# Altium schematic sheet sensors.SchDoc: On-Board Sensors
size A4; DrawnBy: Juan I Carrano; DocumentNumber: 4; SheetNumber: 4; SheetTotal: 6
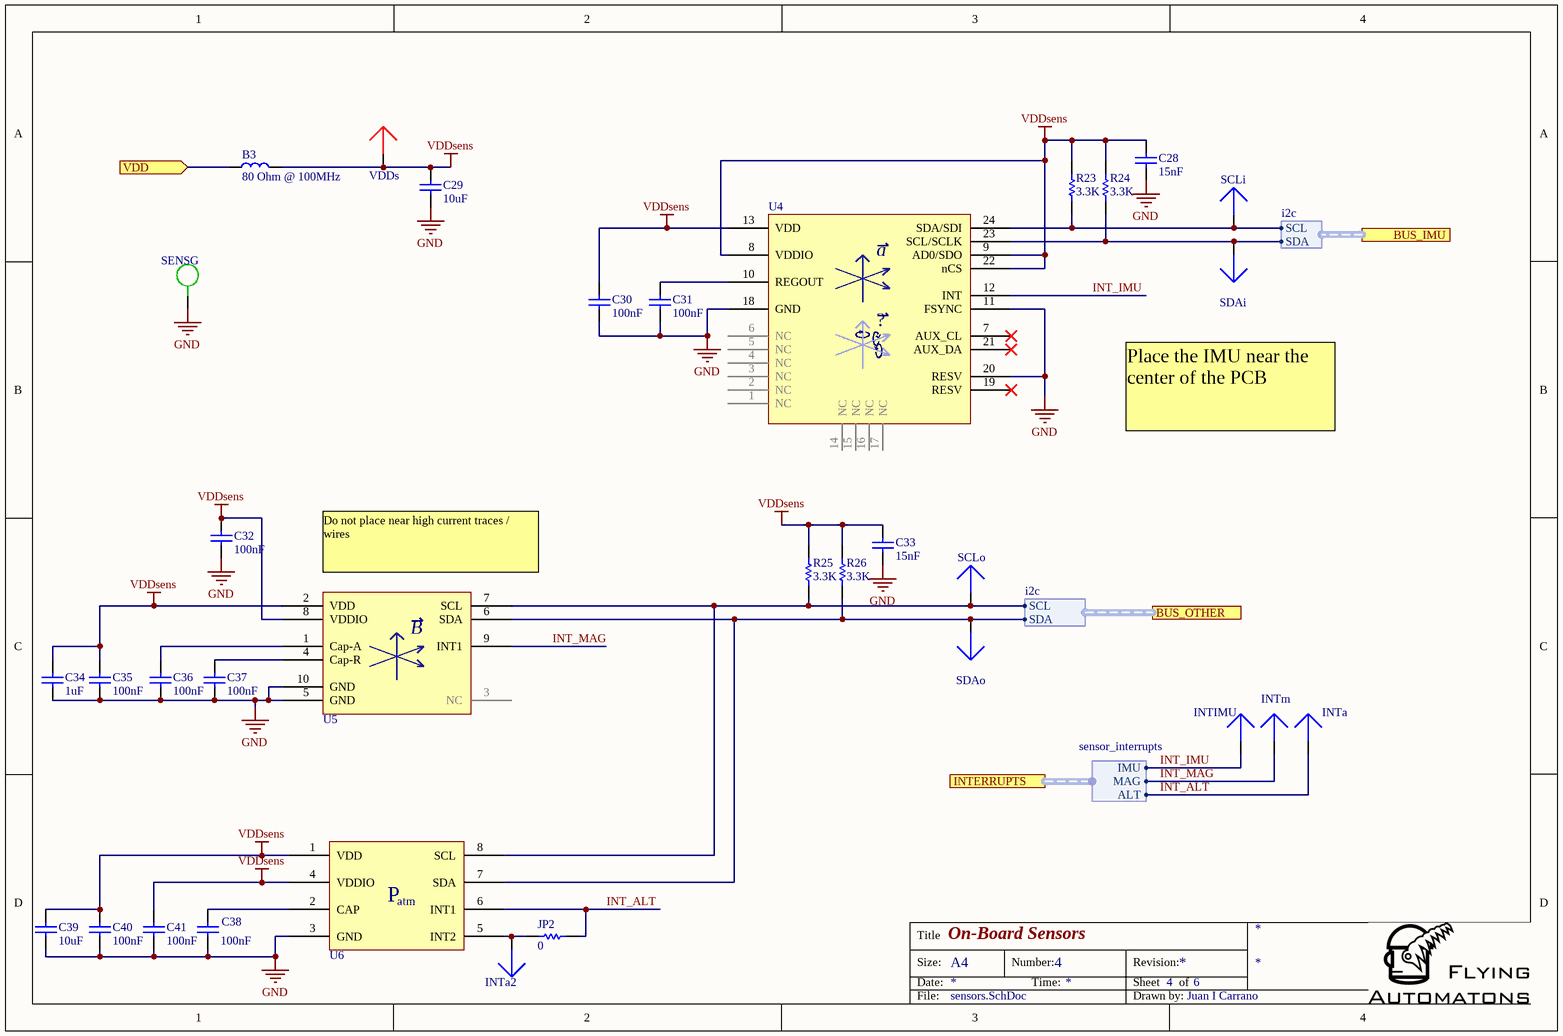
[diagram p0: sensors.SchDoc]

## Parts
B3  80 Ohm @ 100MHz  [INDC1608L]
C28  15nF  [CAPC1608L]
C29  10uF  [CAPC3216L]
C30  100nF  [CAPC1608L]
C31  100nF  [CAPC1608L]
C32  100nF  [CAPC1608L]
C33  15nF  [CAPC1608L]
C34  1uF  [CAPC1608L]
C35  100nF  [CAPC1608L]
C36  100nF  [CAPC1608L]
C37  100nF  [CAPC1608L]
C38  100nF  [CAPC1608L]
C39  10uF  [CAPC3216L]
C40  100nF  [CAPC1608L]
C41  100nF  [CAPC1608L]
INTa  TESTPOINT-ARROW-BLUE  [G-PIN_1mm-CIRCLE]  (value not drawn)
INTa2  TESTPOINT-ARROW-BLUE  [G-PIN_1mm-CIRCLE]  (value not drawn)
INTIMU  TESTPOINT-ARROW-BLUE  [G-PIN_1mm-CIRCLE]  (value not drawn)
INTm  TESTPOINT-ARROW-BLUE  [G-PIN_1mm-CIRCLE]  (value not drawn)
JP2  0  [RESC1608L]
R23  3.3K  [RESC1608L]
R24  3.3K  [RESC1608L]
R25  3.3K  [RESC1608L]
R26  3.3K  [RESC1608L]
SCLi  TESTPOINT-ARROW-BLUE  [G-PIN_1mm-CIRCLE]  (value not drawn)
SCLo  TESTPOINT-ARROW-BLUE  [G-PIN_1mm-CIRCLE]  (value not drawn)
SDAi  TESTPOINT-ARROW-BLUE  [G-PIN_1mm-CIRCLE]  (value not drawn)
SDAo  TESTPOINT-ARROW-BLUE  [G-PIN_1mm-CIRCLE]  (value not drawn)
SENSG  TESTPOINT-CIRCLE-GREEN  [G-PIN_1mm-CROSS]  (value not drawn)
U4  MPU-6500  [QFN40P300X300X95-24N]  (value not drawn)
U5  MAG3110  [SON40P200X200X80-10WL]  (value not drawn)
U6  MPL3115A2  [x-FREE_2053-01(LGA8)]  (value not drawn)
VDDs  TESTPOINT-ARROW-RED  [G-PIN_1mm-CIRCLE]  (value not drawn)

## Ports
BUS_IMU (harness i2c), BUS_OTHER (harness i2c), INTERRUPTS (harness sensor_interrupts), VDD (in)

## Harnesses
sensor_interrupts: IMU, MAG, ALT
i2c: SCL, SDA

## Nets
GND: C28.2 C29.2 C30.2 C31.1 C32.2 C33.2 C34.2 C35.2 C36.2 C37.2 C38.2 C39.2 C40.2 C41.2 SENSG.1 U4.11(FSYNC) U4.18(GND) U4.20(RESV) U5.5(GND) U5.10(GND) U6.3(GND)
VDDsens: B3.2 C28.1 C29.1 C30.1 C32.1 C33.1 C34.1 C35.1 C39.1 C40.1 C41.1 R23.1 R24.1 R25.1 R26.1 U4.8(VDDIO) U4.9(AD0/SDO) U4.13(VDD) U4.22(nCS) U5.2(VDD) U5.8(VDDIO) U6.1(VDD) U6.4(VDDIO) VDDs.1
INT_ALT: INTa.1 JP2.1 U6.6(INT1) ; port INTERRUPTS.ALT
INT_IMU: INTIMU.1 U4.12(INT) ; port INTERRUPTS.IMU
INT_MAG: INTm.1 U5.9(INT1) ; port INTERRUPTS.MAG
VDD: B3.1 ; port VDD
NetC31_2: C31.2 U4.10(REGOUT)
NetC36_1: C36.1 U5.1(Cap-A)
NetC37_1: C37.1 U5.4(Cap-R)
NetC38_1: C38.1 U6.2(CAP)
NetINTa2_1: INTa2.1 JP2.2 U6.5(INT2)
NetR23_2: R23.2 SCLi.1 U4.24(SDA/SDI) ; port BUS_IMU.SCL
NetR24_2: R24.2 SDAi.1 U4.23(SCL/SCLK) ; port BUS_IMU.SDA
NetR25_2: R25.2 SCLo.1 U5.7(SCL) U6.8(SCL) ; port BUS_OTHER.SCL
NetR26_2: R26.2 SDAo.1 U5.6(SDA) U6.7(SDA) ; port BUS_OTHER.SDA

Not connected (* = marked no-connect by the designer): U4 1(NC) 2(NC) 3(NC) 4(NC) 5(NC) 6(NC) 7(AUX_CL)* 14(NC) 15(NC) 16(NC) 17(NC) 19(RESV)* 21(AUX_DA)*; U5 3(NC)

## Notes on the sheet
- Place the IMU near the center of the PCB
- (near U5) Do not place near high current traces / wires
- Title
- Size:
- Date:
- A4
- Number:
- Time:
- Revision:
- Sheet
- of
- File:
- Drawn by:
- (in symbol MAG3110) B
- (in symbol MPL3115A2) P; atm
- (in symbol MPU-6500) a; ?

## Library data of the parts
B3 = FERR_80/100M_0603_600m: FERRITE CHIP 80 OHM 600MA 0603; Manufacturer: Samsung Electro-Mechanics America, Inc; Manufacturer Part Number: CIM10U800NC; Name: FERR_80/100M_0603_600m; Value: 80 Ohm @ 100MHz; Supplier 1: Digi-Key; Supplier Part Number 1: 1276-6386-1-ND
C28 C33 = CAP_15n_0603_50V_X7R_10%: CAP CER 0.015UF 50V 10% X7R 0603; Manufacturer Part Number: CL10B153KB8SFNC; Name: CAP_15n_0603_50V_X7R_10%; Value: 15nF; Supplier 1: Digi-Key; Supplier Part Number 1: 1276-1967-1-ND
C29 C39 = CAP_10u_1206_25V_Y5V: CAP CER 10UF 25V Y5V 1206; Manufacturer Part Number: TMK316F106ZL-T; Name: CAP_10u_1206_25V_Y5V; Value: 10uF; Supplier 1: Digi-Key; Supplier Part Number 1: 587-1353-1-ND
C30-C32 C35-C38 C40 C41 = CAP_100n_0603_50V_Y5V: CAP CER 0.1UF 50V Y5V 0603; Manufacturer Part Number: CC0603ZRY5V9BB104; Name: CAP_100n_0603_50V_Y5V; Value: 100nF; Supplier 1: Digi-Key; Supplier Part Number 1: 311-1343-1-ND
C34 = CAP_1u_0603_25V_X5R_10%: CAP CER 1UF 25V 10% X5R 0603; Manufacturer Part Number: TMK107BJ105KA-T; Name: CAP_1u_0603_25V_X5R_10%; Value: 1uF; Supplier 1: Digi-Key; Supplier Part Number 1: 587-1248-1-ND
INTa INTa2 INTIMU INTm SCLi SCLo SDAi SDAo = TESTP_SIG_1mm: Tespoint; Name: TESTP_SIG_1mm
JP2 = RES_0_0603_0W1_1%: RES 0.0 OHM 1/10W JUMP 0603; Manufacturer Part Number: RC1608J000CS; Name: RES_0_0603_0W1_1%; Value: 0; Supplier 1: Digi-Key; Supplier Part Number 1: 1276-3510-1-ND
R23-R26 = RES_3K3_0603_0W1_1%: RES 3.3K OHM 1/10W 1% 0603 SMD; Manufacturer: Rohm Semiconductor; Manufacturer Part Number: MCR03ERTF3301; Name: RES_3K3_0603_0W1_1%; Value: 3.3K; Supplier 1: Digi-Key; Supplier Part Number 1: RHM3.30KCFCT-ND
SENSG = TESTP_GND_GREEN_1mm: Ground Connection; Name: TESTP_GND_GREEN_1mm
U4 = MPU-6500: GYRO/ACCELEROMETER 6AXIS 24QFN; Manufacturer: Invensense; Name: MPU-6500; Manufacturer Part Number: MPU-6500; Value: MPU-6500; Supplier 1: Digi-Key; Supplier Part Number 1: 1428-1011-1-ND
U5 = MAG3110: XYZ Digital Magnetometer I2C; Manufacturer: Freescale Semiconductor; Manufacturer Part Number: MAG3110FCR1; Name: MAG3110; Value: MAG3110
U6 = MPL3115A2: IC ALTIMETER I2C VERSION 8LGA; Manufacturer: Freescale Semiconductor; Name: MPL3115A2; Manufacturer Part Number: MPL3115A2; Value: MPL3115A2; Supplier 1: Digi-Key; Supplier Part Number 1: MPL3115A2-ND
VDDs = TESTP_PWR_1mm: Tespoint for Power Trace; Name: TESTP_PWR_1mm